# EAGLE design fabisp (EAGLE 6.5.0)
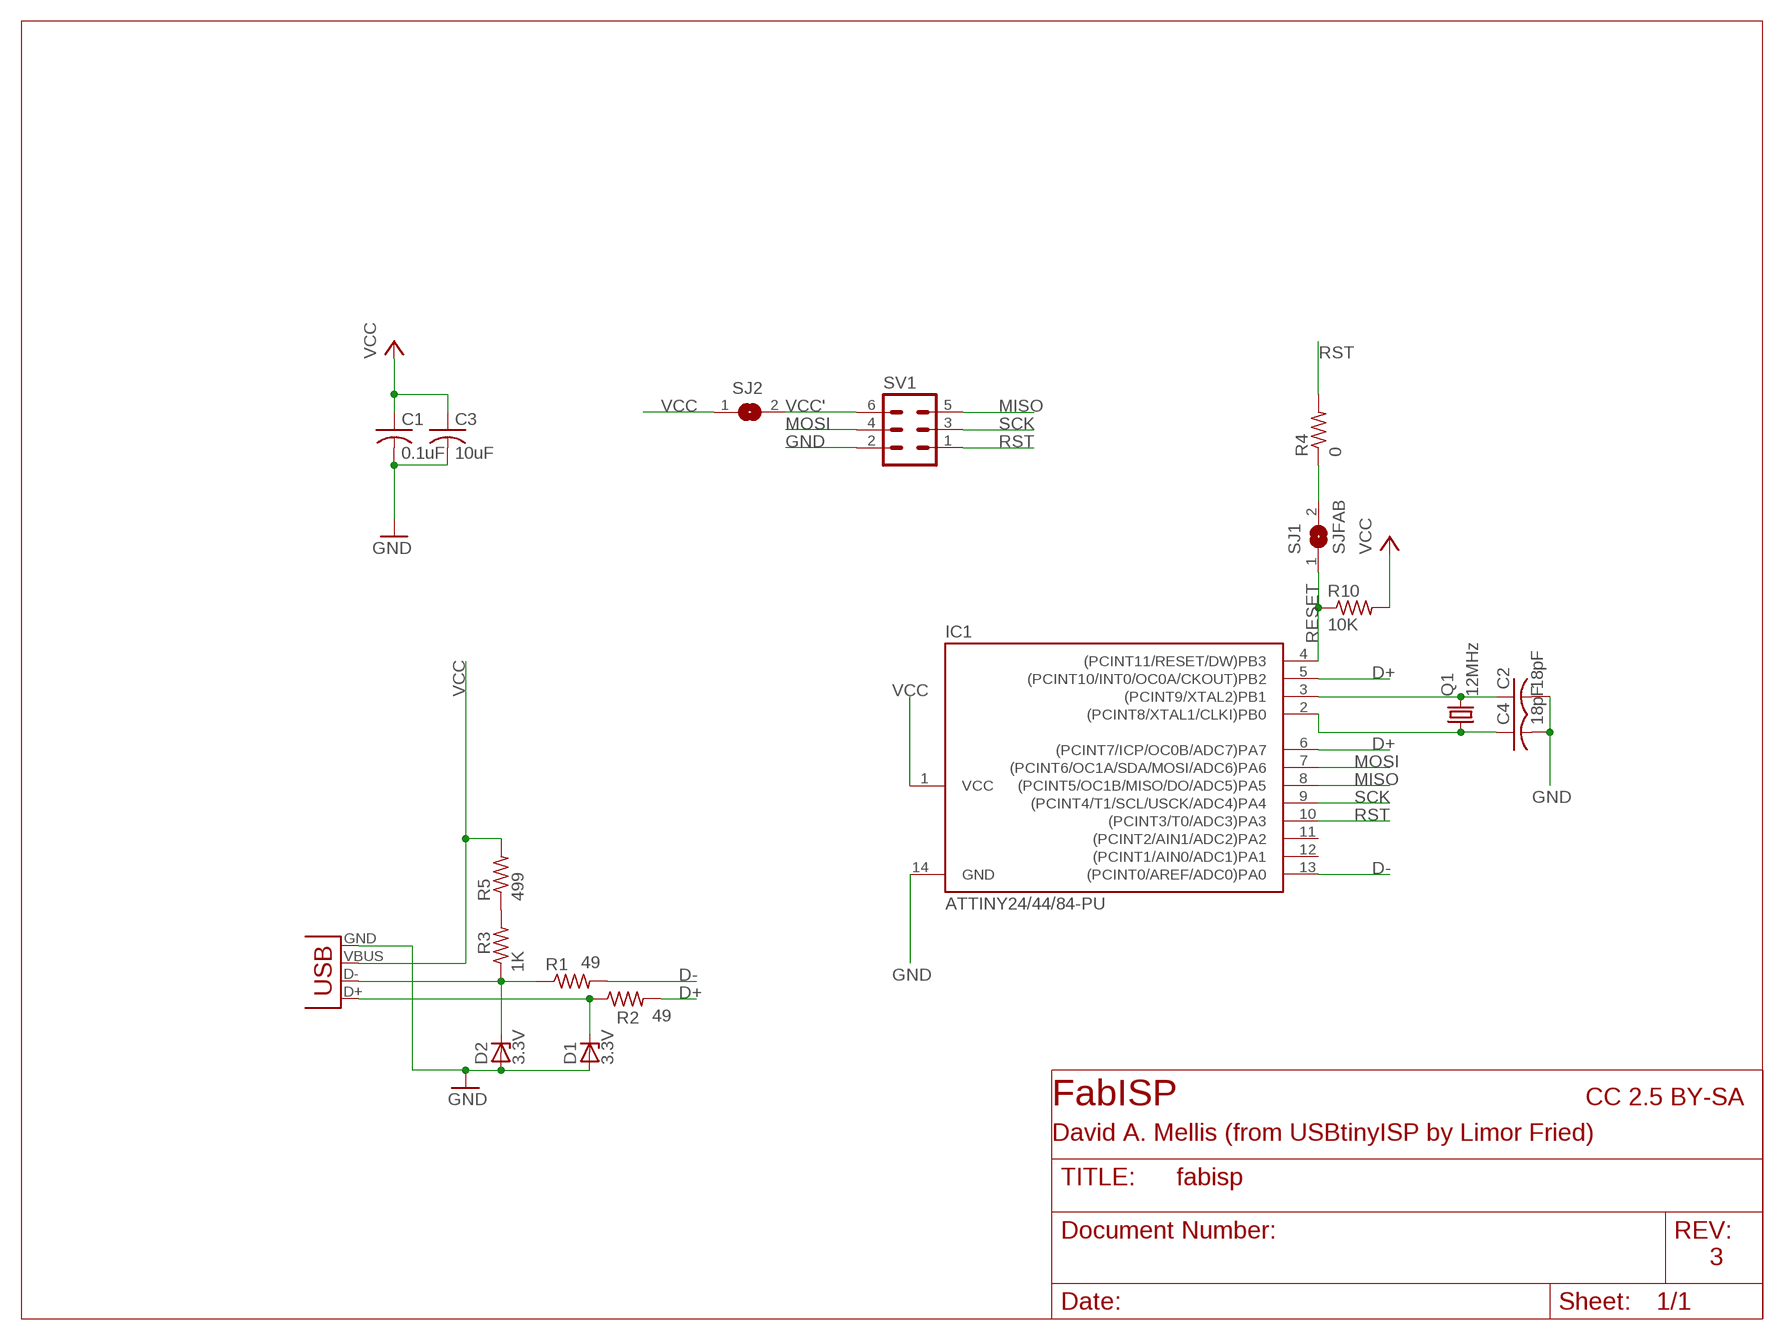
[diagram p0: schematic, sheet 1]

## Parts
C1  0.1uF  C-US025-024X044  [C025-024X044]
C2  18pF  C-US025-024X044  [C025-024X044]
C3  10uF  C-US025-024X044  [C025-024X044]
C4  18pF  C-US025-024X044  [C025-024X044]
D1  3.3V  ZENER_DIODEDO41Z10  [DO41Z10]
D2  3.3V  ZENER_DIODEDO41Z10  [DO41Z10]
IC1  ATTINY24/44/84-PU  [DIL14]
Q1  12MHz  CRYSTALHC49U-V  [HC49U-V]
R1  49  R-US_0204/7  [0204/7]
R2  49  R-US_0204/7  [0204/7]
R3  1K  R-US_0204/7  [0204/7]
R4  0  R-US_0204/7  [0204/7]
R5  499  R-US_0204/7  [0204/7]
R10  10K  R-US_0204/7  [0204/7]
SJ1  SJFAB  [SJFAB]
SJ2  SJFAB  [SJFAB]
SV1  MA03-2  [MA03-2]
X1  USB_MINIB  [USB_MINIB]

## Nets
D+: IC1.5((PCINT10/INT0/OC0A/CKOUT)PB2) IC1.6((PCINT7/ICP/OC0B/ADC7)PA7) R2.2
D-: IC1.13((PCINT0/AREF/ADC0)PA0) R1.2
GND: C1.2 C2.2 C3.2 C4.2 D1.A(ANODE) D2.A(ANODE) IC1.14(GND) SV1.2 X1.GND
MISO: IC1.8((PCINT5/OC1B/MISO/DO/ADC5)PA5) SV1.5
MOSI: IC1.7((PCINT6/OC1A/SDA/MOSI/ADC6)PA6) SV1.4
N$1: D2.C(CATHODE) R1.1 R3.1 X1.D-
N$2: D1.C(CATHODE) R2.1 X1.D+
N$3: R4.1 SJ1.2
N$4: C4.1 IC1.2((PCINT8/XTAL1/CLKI)PB0) Q1.1
N$5: C2.1 IC1.3((PCINT9/XTAL2)PB1) Q1.2
N$6: R3.2 R5.1
RESET: IC1.4((PCINT11/RESET/DW)PB3) R10.1 SJ1.1
RST: IC1.10((PCINT3/T0/ADC3)PA3) R4.2 SV1.1
SCK: IC1.9((PCINT4/T1/SCL/USCK/ADC4)PA4) SV1.3
VCC: C1.1 C3.1 IC1.1(VCC) R5.2 R10.2 SJ2.1 X1.VBUS
VCC': SJ2.2 SV1.6
Unconnected: IC1.11((PCINT2/AIN1/ADC2)PA2) IC1.12((PCINT1/AIN0/ADC1)PA1)

## Notes on the sheet
- FabISP | CC 2.5 BY-SA
- David A. Mellis (from USBtinyISP by Limor Fried)
- 3

## Library data of the parts
C1 = rcl-ez:C-US: CAPACITOR, American symbol
C2-C4 = rcl:C-US: CAPACITOR, American symbol
D1 D2 = ng:ZENER_DIODE: zener diode
IC1 = attiny24_44_84:ATTINY24/44/84
Q1 = crystal:CRYSTAL: CRYSTAL
R1-R3 R10 = rcl-ez:R-US_: RESISTOR, American symbol
R4 R5 = rcl:R-US_: RESISTOR, American symbol
SJ1 SJ2 = mellis:SJFAB
SV1 = con-lstb:MA03-2: PIN HEADER; OC_FARNELL: unknown; OC_NEWARK: unknown
X1 = mellis:USB_MINIB

## Board
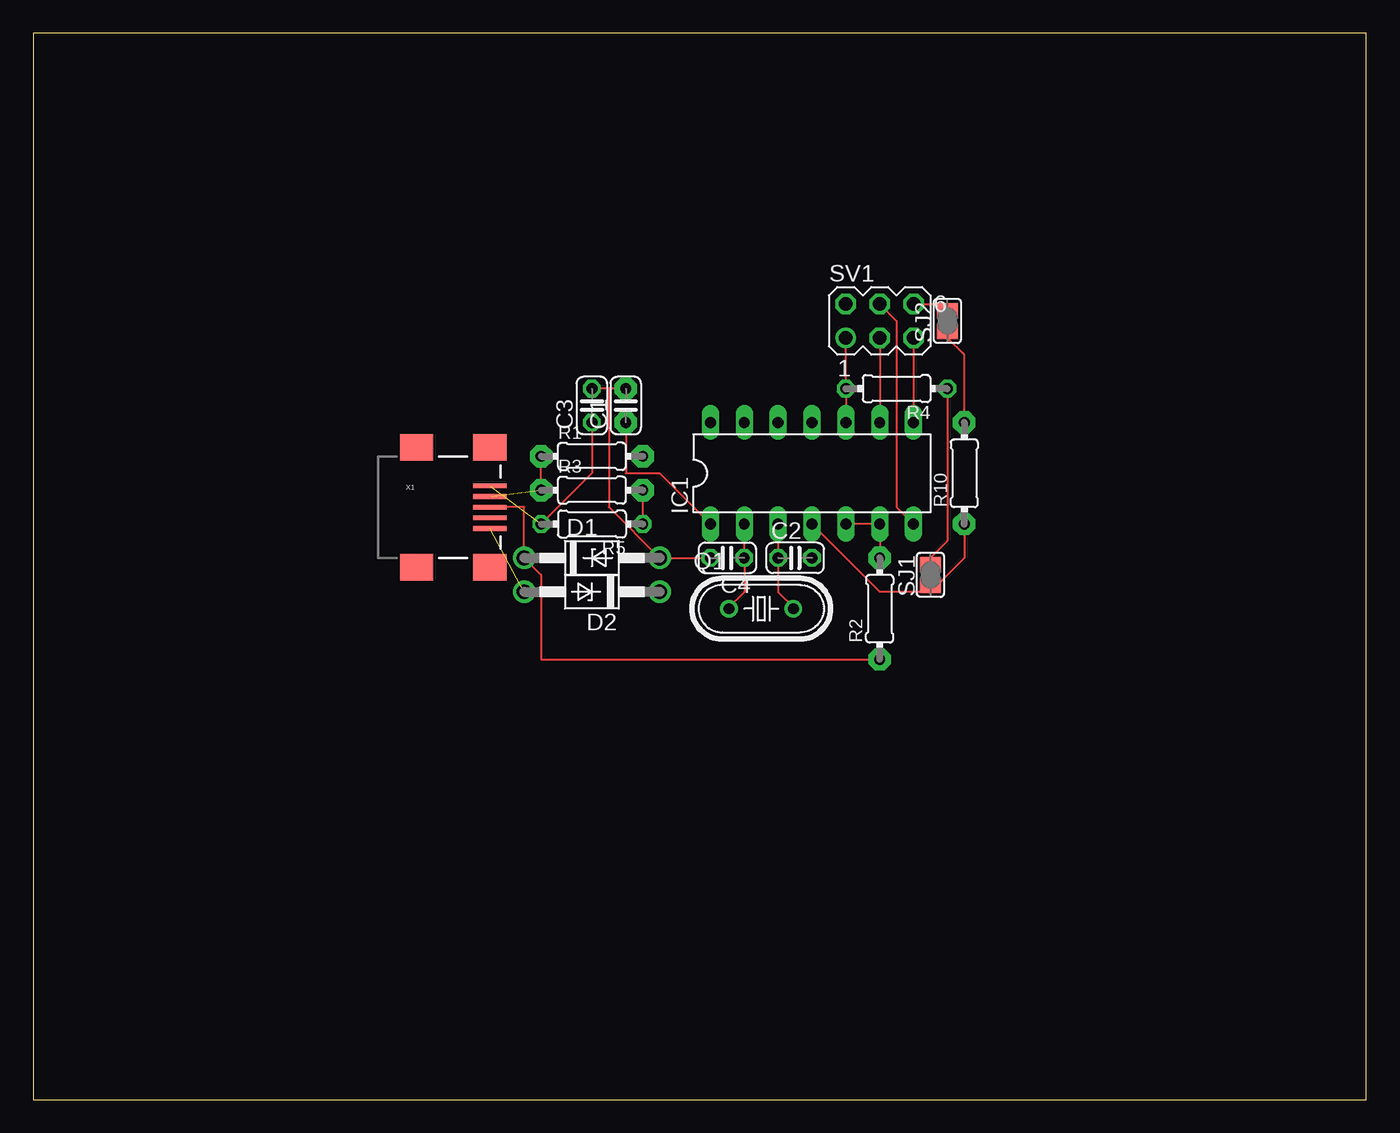
[diagram p1: board, top side]
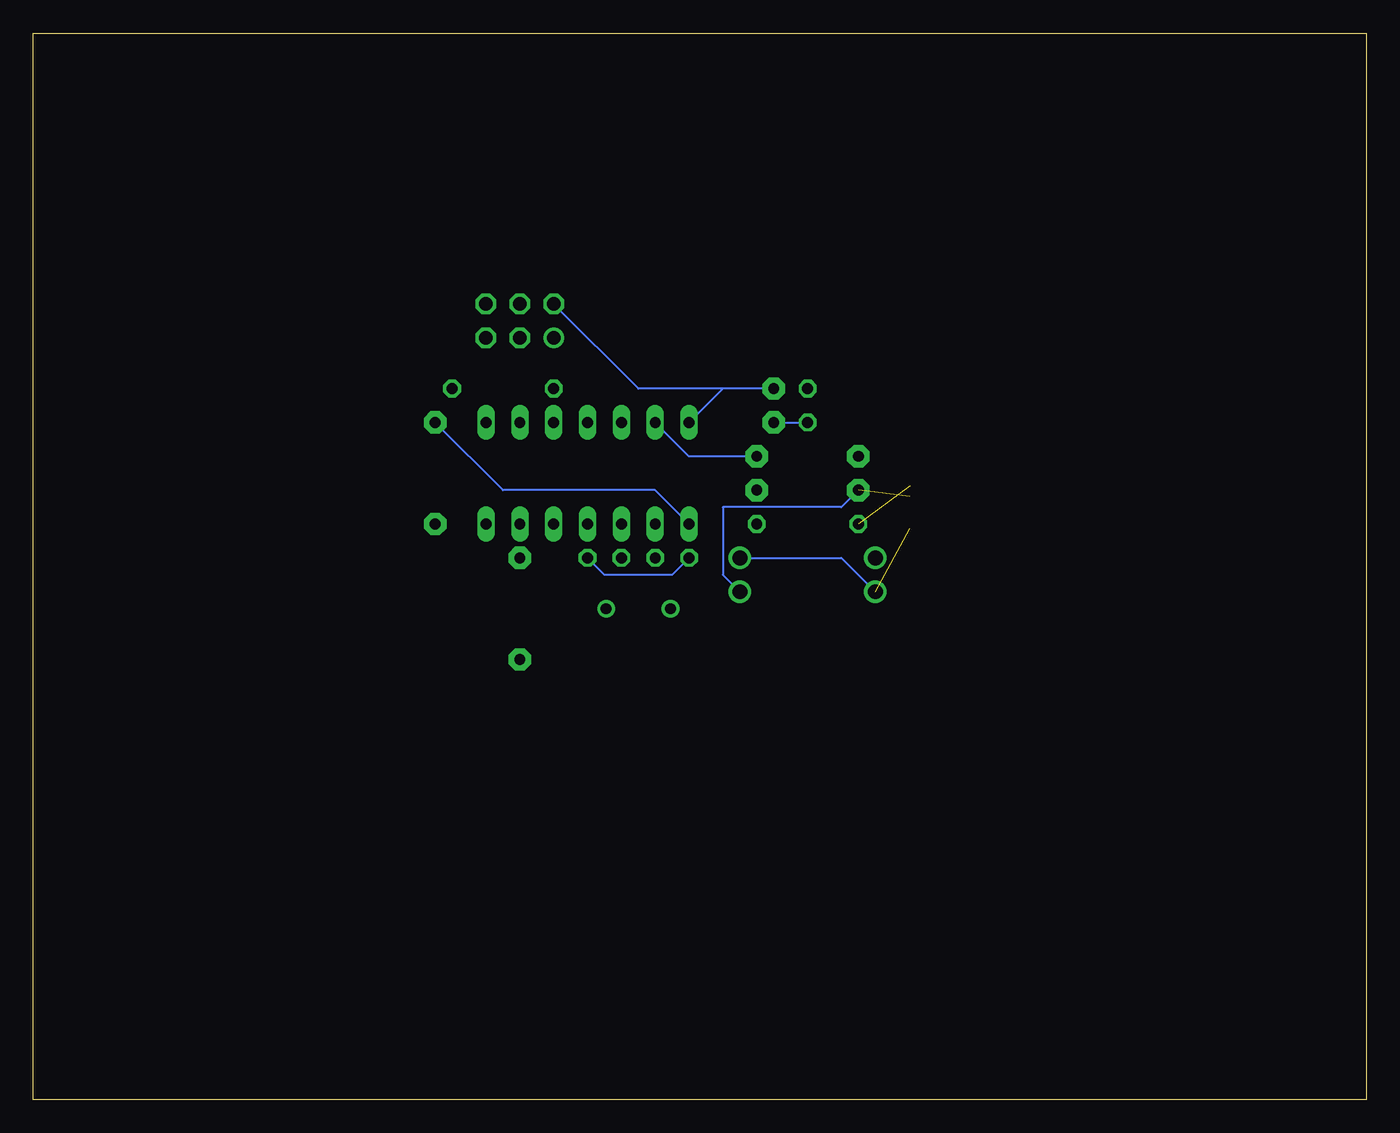
[diagram p2: board, bottom side, seen from below]

Size 100 x 80 mm. Coordinates in mm from the lower left corner, seen from the top.
Outline: 0,0 100,0 100,80 0,80 0,0
Copper layers (1*16): Top 0.035mm / dielectric 1.5mm / Bottom 0.035mm
Design rules "SeeedStudio_rule_no_angle_090911": minimum track width 6mil, minimum drill 12mil, track to track 6mil, track to pad 6mil, pad to pad 6mil, via to via 6mil, smd to smd 0mil, copper to edge 10mil, drill to drill 10mil, minimum pad ring 10mil, minimum via ring 6mil, stop-mask expansion 2mil, vias tented up to drill 100mil, thermal gap 10mil

### Footprints (pad centres in the part's own frame; a part is rotated, then mirrored left to right if it is on the bottom)
C025-024X044 = drill 0.813 pad 1.676 octagon: 1 -1.27,0; 2 1.27,0
C025-024X044' = drill 0.813 octagon: 1 -1.27,0; 2 1.27,0
DO41Z10 = drill 1.118: A 5.08,0; C -5.08,0
DIL14 = drill 0.813 long: 1 -7.62,-3.81; 2 -5.08,-3.81; 3 -2.54,-3.81; 4 0,-3.81; 5 2.54,-3.81; 6 5.08,-3.81; 7 7.62,-3.81; 8 7.62,3.81; 9 5.08,3.81; 10 2.54,3.81; 11 0,3.81; 12 -2.54,3.81; 13 -5.08,3.81; 14 -7.62,3.81
HC49U-V = drill 0.813: 1 -2.413,0; 2 2.413,0
0204/7 = drill 0.813 pad 1.676 octagon: 1 -3.81,0; 2 3.81,0
0204/7' = drill 0.813 octagon: 1 -3.81,0; 2 3.81,0
SJFAB = smd 1.118 x 1.6: 1 -0.787,0; 2 0.787,0
MA03-2 = drill 1.016: 1 -2.54,-1.27 | drill 1.016 octagon: 2 -2.54,1.27; 3 0,-1.27; 4 0,1.27; 5 2.54,-1.27; 6 2.54,1.27
USB_MINIB = smd 2.5 x 0.35: D+ 3.77,0; D- 3.77,0.8; GND 3.77,-1.6; ID 3.77,-0.8; VBUS 3.77,1.6 | smd 2.5 x 2: GND@1 -1.73,-4.5; GND@2 -1.73,4.5; GND@3 3.77,4.5; GND@4 3.77,-4.5

### Placement (x,y rotation side)
C1  44.45,52.07 90 top
C2  18pF  [C025-024X044']  57.15,40.64 0 top
C3  10uF  [C025-024X044']  41.91,52.07 90 top
C4  18pF  [C025-024X044']  52.07,40.64 180 top
D1  41.91,40.64 0 top
D2  41.91,38.1 180 top
IC1  58.42,46.99 0 top
Q1  54.61,36.83 0 top
R1  41.91,48.26 0 top
R2  63.5,36.83 90 top
R3  41.91,45.72 0 top
R4  0  [0204/7']  64.77,53.34 180 top
R5  499  [0204/7']  41.91,43.18 180 top
R10  69.85,46.99 90 top
SJ1  67.31,39.37 90 top
SJ2  68.58,58.42 90 top
SV1  63.5,58.42 0 top
X1  30.48,44.45 0 top

### Tracks (layer width: path | path; a pad name or v marks a point on that pad's centre or on a via)
D+
  Top 0.152: IC1.5 IC1.6 R2.2
D-
  Bottom 0.152: IC1.13 50.8,48.26 R1.2
GND  (1 unrouted)
  Top 0.152: C4.2 D1.A 43.18,44.45 43.18,53.34 | C1.2 43.18,53.34 | 43.18,53.34 C3.2
  Bottom 0.152: C2.2 57.15,39.37 52.07,39.37 C4.2 | D2.A 39.37,40.64 D1.A | 48.26,53.34 IC1.14 | C1.2 48.26,53.34 | SV1.2 54.61,53.34 48.26,53.34
MISO
  Top 0.152: SV1.5 IC1.8
MOSI
  Top 0.152: IC1.7 64.77,44.45 64.77,58.42 SV1.4
N$1  (1 unrouted)
  Top 0.152: R3.1 R1.1
  Bottom 0.152: D2.C 48.26,39.37 48.26,44.45 39.37,44.45 R3.1
N$2
  Top 0.152: X1.D+ 36.83,44.45 D1.C 38.1,39.37 38.1,33.02 R2.1
N$3
  Top 0.152: R4.1 68.58,41.91 67.31,40.64 SJ1.2
N$4
  Top 0.152: Q1.1 52.07,36.83 53.34,38.1 C4.1 IC1.2
N$5
  Top 0.152: IC1.3 C2.1 55.88,38.1 57.15,36.83 Q1.2
N$6
  Top 0.152: R3.2 R5.1
RESET
  Top 0.152: 67.31,38.1 69.85,40.64 R10.1 | IC1.4 63.5,38.1 67.31,38.1 | 67.31,38.1 SJ1.1
RST
  Top 0.152: IC1.10 R4.2 SV1.1
SCK
  Top 0.152: SV1.3 IC1.9
VCC  (1 unrouted)
  Top 0.152: R5.2 41.91,46.99 C3.1 | R10.2 69.85,55.88 68.58,57.15 SJ2.1 | IC1.1 46.99,46.99 44.45,46.99 C1.1
  Bottom 0.152: R10.2 64.77,45.72 53.34,45.72 IC1.1 | C1.1 C3.1
VCC'
  Top 0.152: SV1.6 68.58,59.69 SJ2.2